# EAGLE design gasLP_Control (EAGLE 7.5.0)
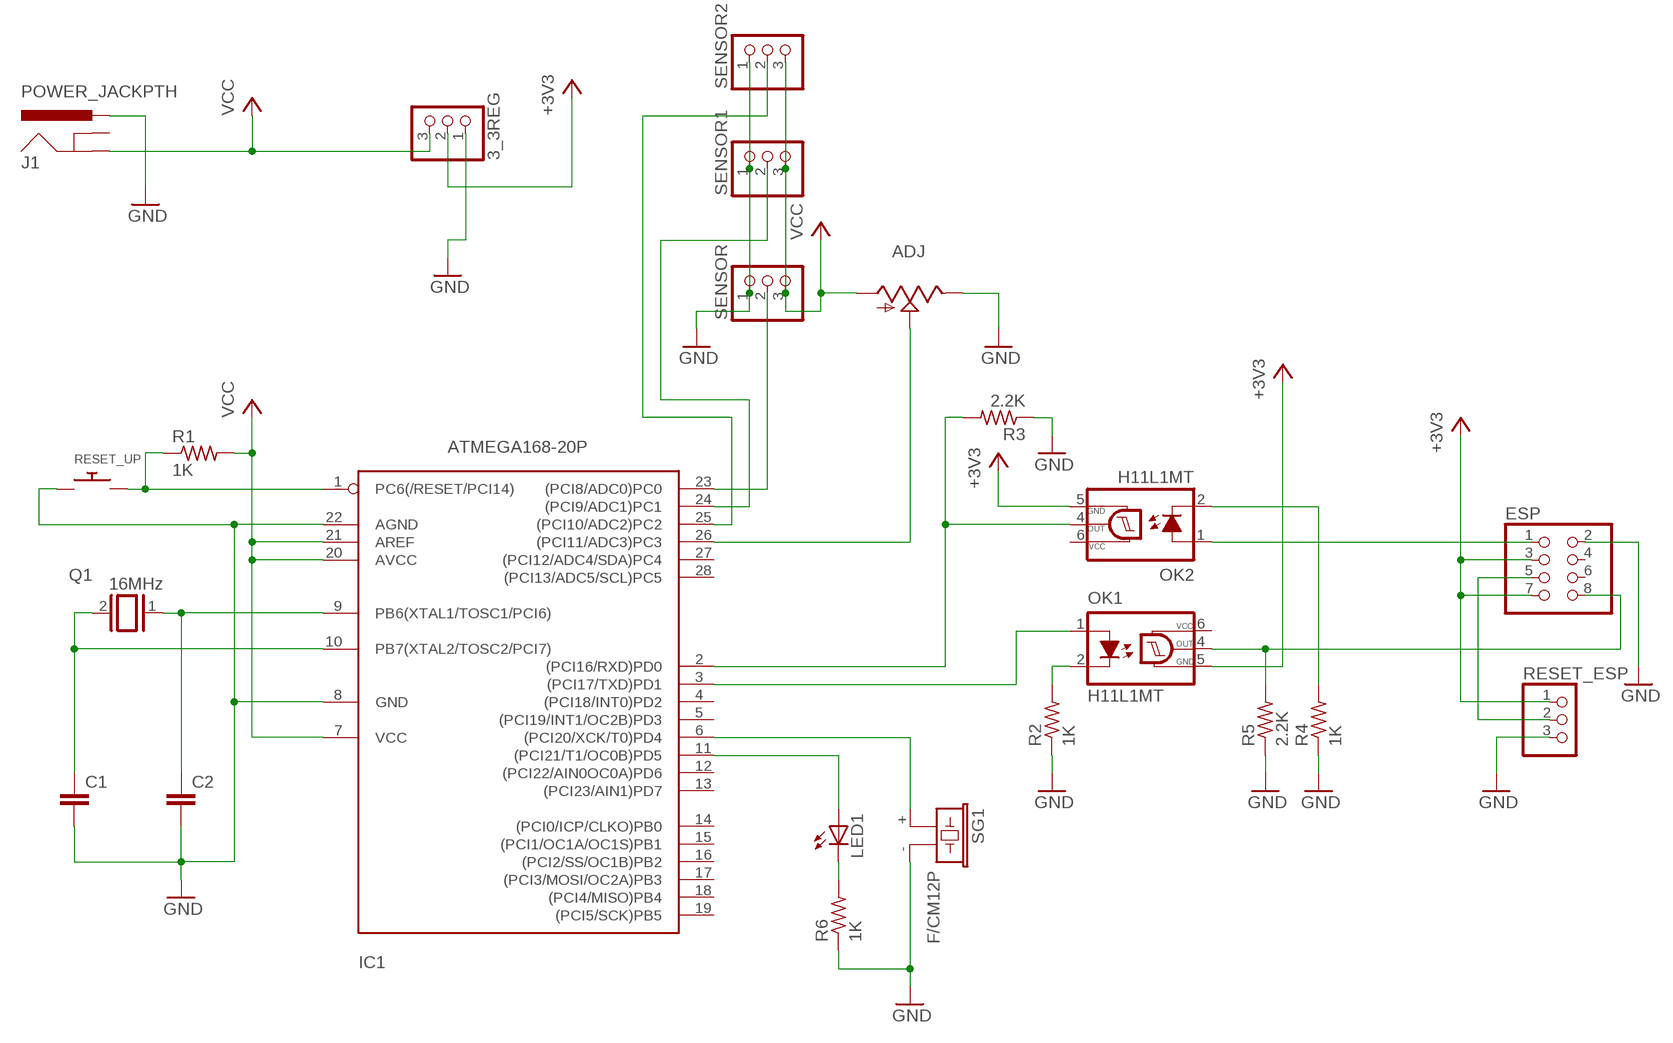
[diagram p0: schematic, sheet 1]

## Parts
3_3REG  PINHD-1X3  [1X03]
ADJ  TRIM_US-B25P  [B25P]
C1  C-EU025-050X050  [C025-050X050]
C2  C-EU025-050X050  [C025-050X050]
ESP  PINHD-2X4  [2X04]
IC1  ATMEGA168-20P  [DIL28-3]
J1  POWER_JACKPTH  [POWER_JACK_PTH]
LED1  LED5MM  [LED5MM]
OK1  H11L1MT  [DIL6-04]
OK2  H11L1MT  [DIL6-04]
Q1  16MHz  XTAL  [Q]
R1  1K  R-US_0204/7  [0204/7]
R2  1K  R-US_0204/7  [0204/7]
R3  2.2K  R-US_0204/7  [0204/7]
R4  1K  R-US_0204/7  [0204/7]
R5  2.2K  R-US_0204/7  [0204/7]
R6  1K  R-US_0204/7  [0204/7]
RESET_ESP  PINHD-1X3  [1X03]
RESET_UP  SWITCH_PUSHBUTTONEVQ-PE  [TACT_PANA-EVQ]
SENSOR  PINHD-1X3  [1X03]
SENSOR1  PINHD-1X3  [1X03]
SENSOR2  PINHD-1X3  [1X03]
SG1  F/CM12P  [F/CM12P]

## Nets
+3V3: 3_3REG.2 ESP.3 ESP.7 OK1.5(GND) OK2.5(GND) RESET_ESP.1
GND: 3_3REG.1 ADJ.E C1.2 C2.2 ESP.2 IC1.8(GND) IC1.22(AGND) J1.PWR R2.1 R3.1 R4.1 R5.1 R6.1 RESET_ESP.3 RESET_UP.P$1 SENSOR1.1 SENSOR2.1 SENSOR.1 SG1.-
N$1: C1.1 IC1.10(PB7(XTAL2/TOSC2/PCI7)) Q1.2
N$2: C2.1 IC1.9(PB6(XTAL1/TOSC1/PCI6)) Q1.1
N$3: IC1.3((PCI17/TXD)PD1) OK1.1(A)
N$4: OK1.2(C) R2.2
N$5: IC1.1(PC6(/RESET/PCI14)) R1.1 RESET_UP.P$2
N$6: IC1.2((PCI16/RXD)PD0) OK2.4(OUT) R3.2
N$7: IC1.6((PCI20/XCK/T0)PD4) SG1.+
N$8: OK2.2(C) R4.2
N$9: ESP.8 OK1.4(OUT) R5.2
N$10: ESP.1 OK2.1(A)
N$11: ESP.5 RESET_ESP.2
N$12: IC1.11((PCI21/T1/OC0B)PD5) LED1.A
N$13: LED1.K(C) R6.2
N$14: IC1.23((PCI8/ADC0)PC0) SENSOR.2
N$16: ADJ.S IC1.26((PCI11/ADC3)PC3)
N$17: IC1.24((PCI9/ADC1)PC1) SENSOR1.2
N$18: IC1.25((PCI10/ADC2)PC2) SENSOR2.2
VCC: 3_3REG.3 ADJ.A IC1.7(VCC) IC1.20(AVCC) IC1.21(AREF) J1.GND R1.2 SENSOR1.3 SENSOR2.3 SENSOR.3
Unconnected: ESP.4 ESP.6 IC1.4((PCI18/INT0)PD2) IC1.5((PCI19/INT1/OC2B)PD3) IC1.12((PCI22/AIN0OC0A)PD6) IC1.13((PCI23/AIN1)PD7) IC1.14((PCI0/ICP/CLKO)PB0) IC1.15((PCI1/OC1A/OC1S)PB1) IC1.16((PCI2/SS/OC1B)PB2) IC1.17((PCI3/MOSI/OC2A)PB3) IC1.18((PCI4/MISO)PB4) IC1.19((PCI5/SCK)PB5) IC1.27((PCI12/ADC4/SDA)PC4) IC1.28((PCI13/ADC5/SCL)PC5) J1.GNDBREAK

## Power pins joined to a net without a drawn wire
VCC: OK1.6(VCC) OK2.6(VCC)

## Library data of the parts
3_3REG RESET_ESP SENSOR SENSOR1 SENSOR2 = adafruit:PINHD-1X3: PIN HEADER
ADJ = pot:TRIM_US-: POTENTIOMETER
C1 C2 = rcl:C-EU: CAPACITOR, European symbol
ESP = adafruit:PINHD-2X4: PIN HEADER
IC1 = adafruit:ATMEGA168*P: MICROCONTROLLER 16 kBytes FLASH 1 kBytes SRAM 512 Bytes EEPROM USART 8-channel 10 bit ADC
J1 = SparkFun-Connectors:POWER_JACK: Power Jack This is the standard 5.5mm barrel jack for power. The PTH is the most common, proven, reliable, footprint. The Slot footprint only works if the mill layer is transmitted to the PCB fab house so be warned. Mating wall wart : TOL-00298 (and others); PROD_ID: CONN-08197
LED1 = adafruit:LED: LED OSRAM: - CHIPLED LG R971, LG N971, LY N971, LG Q971, LY Q971, LO R971, LY R971 LH N974, LH R974 LS Q976, LO Q976, LY Q976 LO Q996 - Hyper CHIPLED LW Q18S LB Q993, LB Q99A, LB R99A - SideLED LS A670, LO A670, LY A670, LG A670, LP A670 LB A673, LV A673, LT A673, LW A673 LH A674 LY A675 LS A676, LA A676, LO A676, LY A676, LW A676 LS A679, LY A679, LG A679 - Hyper Micro SIDELED® LS Y876, LA Y876, LO Y876, LY Y876 LT Y87S - SmartLED LW L88C, LW L88S LB L89C, LB L89S, LG L890 LS L89K, LO L89K, LY L89K LS L896, LA L896, LO L896, LY L896 - TOPLED LS T670, LO T670, LY T670, LG T670, LP T670 LSG T670, LSP T670, LSY T670, LOP T670, LYG T670 LG T671, LOG T671, LSG T671 LB T673, LV T673, LT T673, LW T673 LH T674 LS T676, LA T676, LO T676, LY T676, LB T676, LH T676, LSB T676, LW T676 LB T67C, LV T67C, LT T67C, LS T67K, LO T67K, LY T67K, LW E67C LS E67B, LA E67B, LO E67B, LY E67B, LB E67C, LV E67C, LT E67C LW T67C LS T679, LY T679, LG T679 LS T770, LO T770, LY T770, LG T770, LP T770 LB T773, LV T773, LT T773, LW T773 LH T774 LS E675, LA E675, LY E675, LS T675 LS T776, LA T776, LO T776, LY T776, LB T776 LHGB T686 LT T68C, LB T68C - Hyper Mini TOPLED® LB M676 - Mini TOPLED Santana® LG M470 LS M47K, LO M47K, LY M47K Source: http://www.osram.convergy.de/
OK1 OK2 = optocoupler:H11L*M: 6-Pin DIP Optocoupler Source: http://www.fairchildsemi.com/ds/H1/H11L2-M.pdf; OC_FARNELL: unknown; OC_NEWARK: unknown
Q1 = special:XTAL: CRYSTAL
R1-R6 = rcl:R-US_: RESISTOR, American symbol
RESET_UP = adafruit:SWITCH_PUSHBUTTON: Buttons SOFTTOUCHSMD_SJ - Soft touch temporary push button (Super Junk Akihabara) Compatible with SKPMANE010 [Mouser: 688-SKPMAN] C&K_KSS = Digikey: KSS221GLFS
SG1 = buzzer:F/CM12P: BUZZER Source: Buerklin; OC_FARNELL: unknown; OC_NEWARK: unknown

## Board
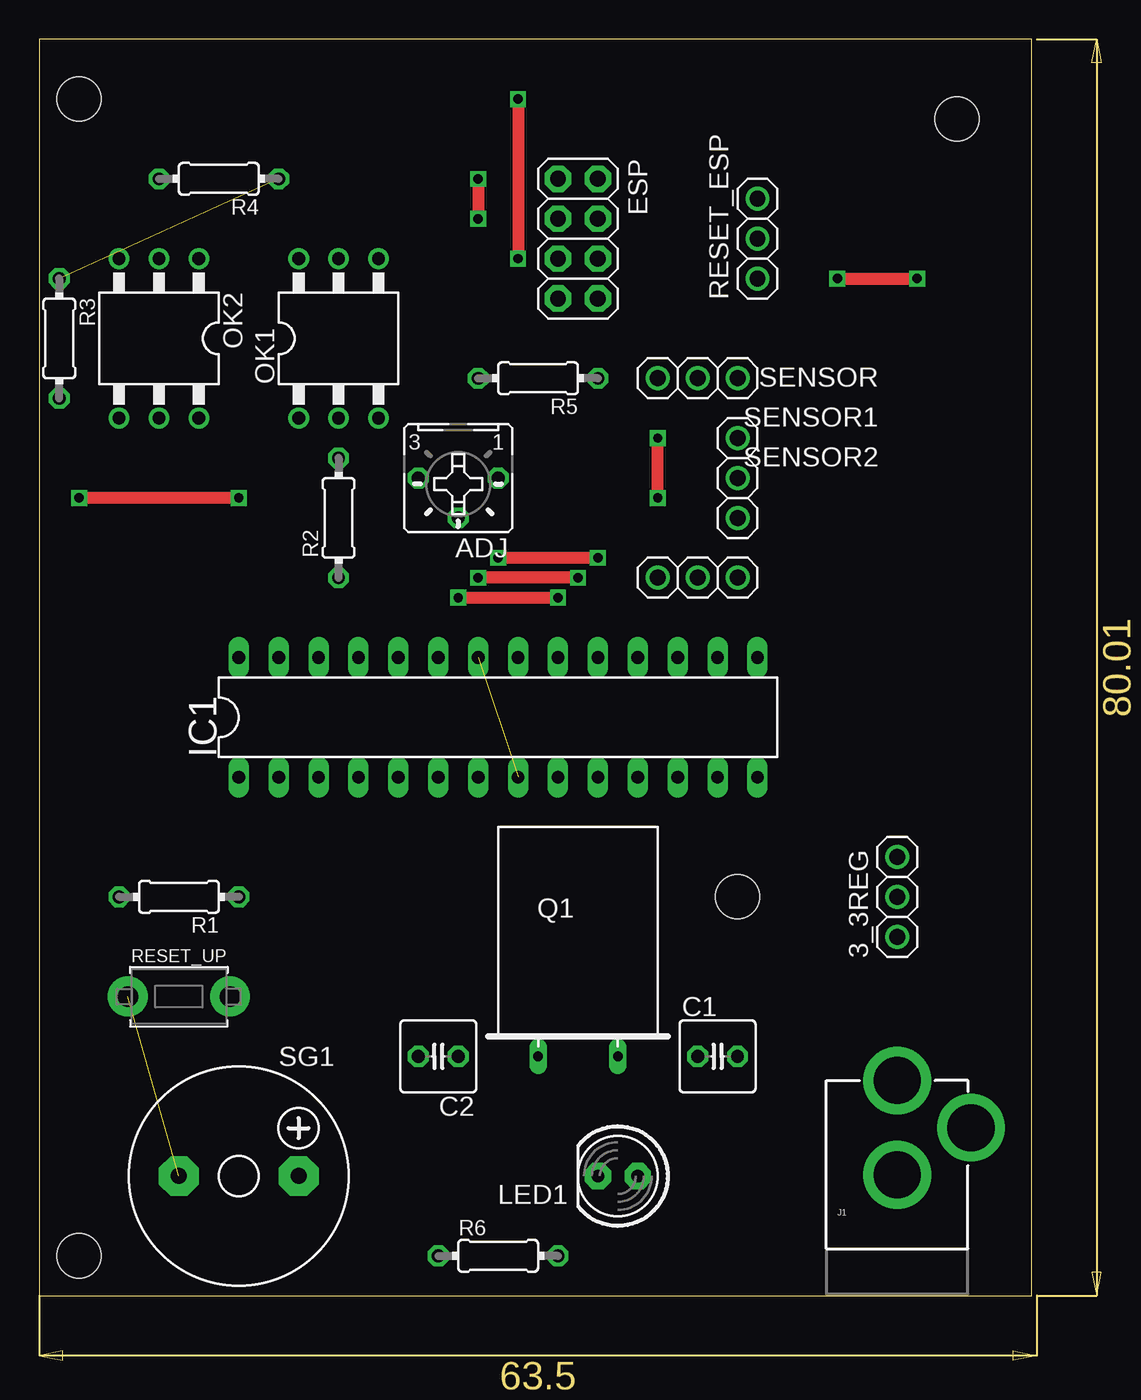
[diagram p1: board, top side]
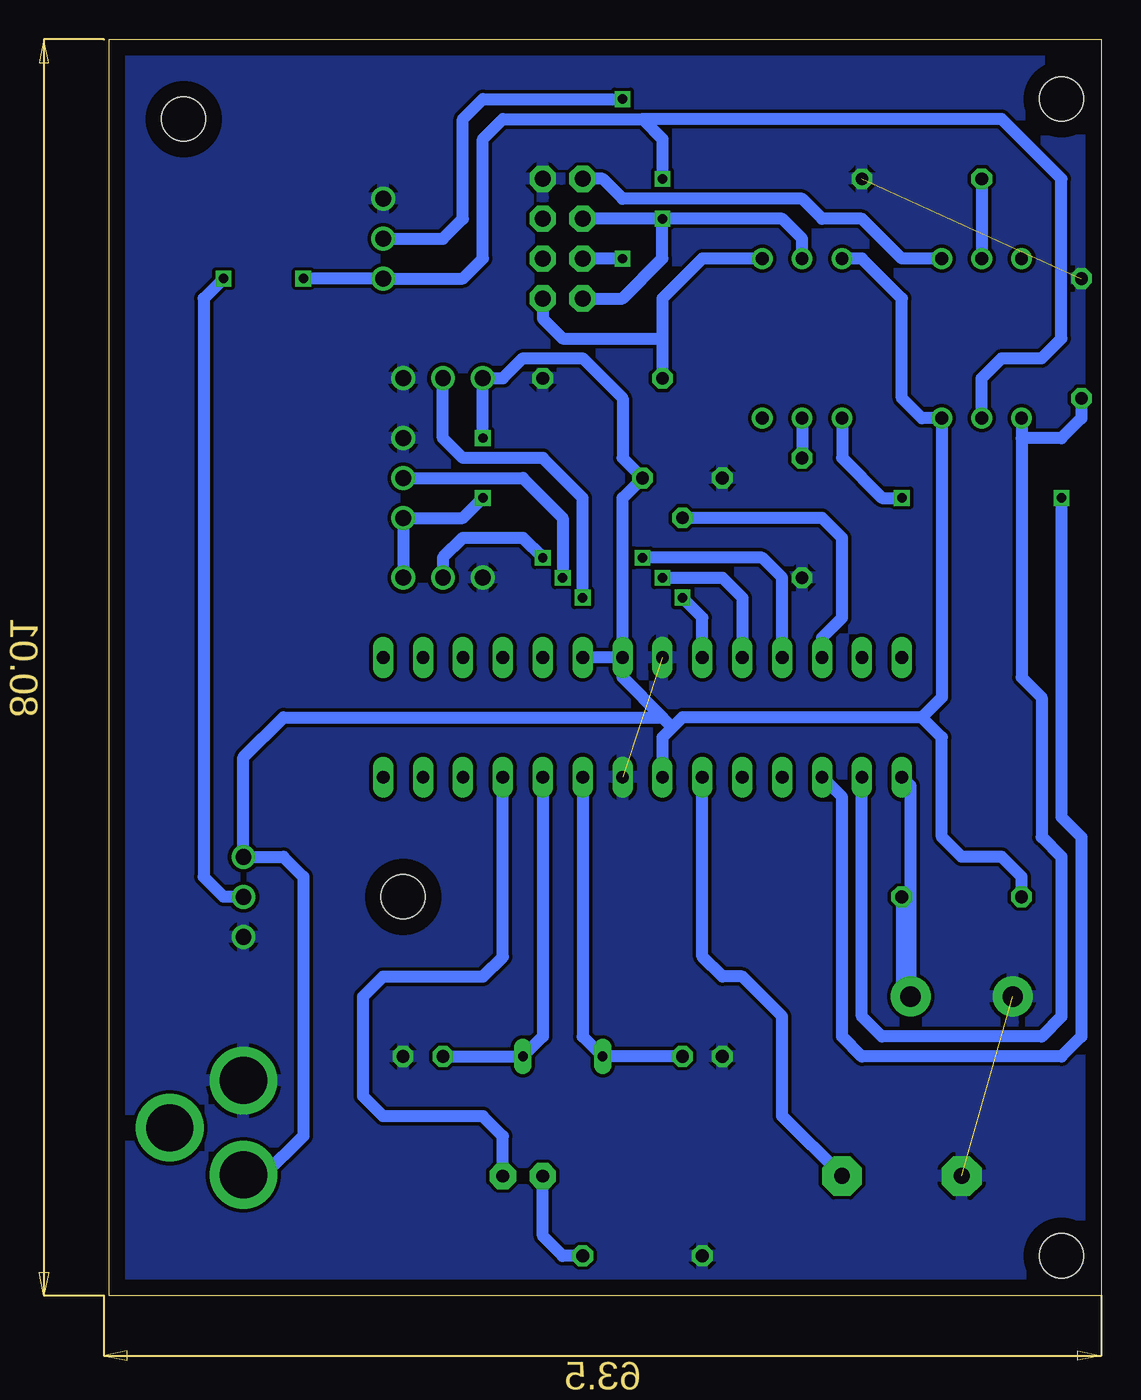
[diagram p2: board, bottom side, seen from below]

Size 63.17 x 80 mm. Coordinates in mm from the lower left corner, seen from the top.
Outline: 0,0 63.17,0 63.17,80 0,80 0,0
Copper layers (1*16): Top 0.035mm / dielectric 1.5mm / Bottom 0.035mm
Design rules "default": minimum track width 10mil, minimum drill 24mil, track to track 8mil, track to pad 8mil, pad to pad 8mil, via to via 8mil, smd to smd 8mil, copper to edge 40mil, drill to drill 8mil, minimum pad ring 10mil, minimum via ring 8mil, stop-mask expansion 4mil, vias tented up to drill 0mil, thermal gap 10mil
Holes 2.8 mm at 58.42,74.93 2.54,76.2 2.54,2.54 44.45,25.4

### Footprints (pad centres in the part's own frame; a part is rotated, then mirrored left to right if it is on the bottom)
1X03 = drill 1.016: 1 -2.54,0; 2 0,0; 3 2.54,0
B25P = drill 0.813 octagon: A -2.54,0; E 2.54,0; S 0,2.54
C025-050X050 = drill 0.813 octagon: 1 -1.27,0; 2 1.27,0
2X04 = drill 1.016 pad 1.676 octagon: 1 -3.81,-1.27; 2 -3.81,1.27; 3 -1.27,-1.27; 4 -1.27,1.27; 5 1.27,-1.27; 6 1.27,1.27; 7 3.81,-1.27; 8 3.81,1.27
DIL28-3 = drill 0.813 long: 1 -16.51,-3.81; 2 -13.97,-3.81; 3 -11.43,-3.81; 4 -8.89,-3.81; 5 -6.35,-3.81; 6 -3.81,-3.81; 7 -1.27,-3.81; 8 1.27,-3.81; 9 3.81,-3.81; 10 6.35,-3.81; 11 8.89,-3.81; 12 11.43,-3.81; 13 13.97,-3.81; 14 16.51,-3.81; 15 16.51,3.81; 16 13.97,3.81; 17 11.43,3.81; 18 8.89,3.81; 19 6.35,3.81; 20 3.81,3.81; 21 1.27,3.81; 22 -1.27,3.81; 23 -3.81,3.81; 24 -6.35,3.81; 25 -8.89,3.81; 26 -11.43,3.81; 27 -13.97,3.81; 28 -16.51,3.81
POWER_JACK_PTH = drill 2.997 pad 4.318: GND 0,7.7; GNDBREAK 4.7,10.7; PWR 0,13.7
LED5MM = drill 0.813 pad 1.676 octagon: A -1.27,0; K 1.27,0
DIL6-04 = drill 0.813: 1 -2.54,-5.08; 2 0,-5.08; 3 2.54,-5.08; 4 2.54,5.08; 5 0,5.08; 6 -2.54,5.08
Q = drill 0.61 long: 1 -2.54,-7.62; 2 2.54,-7.62
0204/7 = drill 0.813 octagon: 1 -3.81,0; 2 3.81,0
TACT_PANA-EVQ = drill 1.3 pad 2.54: P$1 -3.25,0; P$2 3.25,0
F/CM12P = drill 1.016 pad 2.54 octagon: + 3.81,0; - -3.81,0

### Placement (x,y rotation side)
3_3REG  54.61,25.4 90 top
ADJ  26.67,52.07 180 top
C1  43.18,15.24 0 top
C2  25.4,15.24 180 top
ESP  34.29,67.31 270 top
IC1  29.21,36.83 0 top
J1  54.61,0 0 top
LED1  36.83,7.62 180 top
OK1  19.05,60.96 0 top
OK2  7.62,60.96 180 top
Q1  34.29,22.86 0 top
R1  8.89,25.4 180 top
R2  19.05,49.53 90 top
R3  1.27,60.96 270 top
R4  11.43,71.12 180 top
R5  31.75,58.42 180 top
R6  29.21,2.54 0 top
RESET_ESP  45.72,67.31 90 top
RESET_UP  8.89,19.05 0 top
SENSOR  41.91,58.42 180 top
SENSOR1  44.45,52.07 270 top
SENSOR2  41.91,45.72 0 top
SG1  12.7,7.62 0 top

### Tracks (layer width: path | path; a pad name or v marks a point on that pad's centre or on a via)
+3V3  (via drill 0.6)
  Top 0.762: v27.94,71.12 v27.94,68.58 | v50.8,64.77 v55.88,64.77
  Bottom 0.762: OK1.5 19.05,67.31 20.32,68.58 v27.94,68.58 | v27.94,68.58 ESP.3 | ESP.7 30.48,63.5 27.94,66.04 v27.94,68.58 | 29.21,74.93 38.1,74.93 39.37,73.66 39.37,66.04 40.64,64.77 RESET_ESP.1 v50.8,64.77 | 29.21,74.93 27.94,73.66 v27.94,71.12 | OK2.5 7.62,58.42 6.35,59.69 3.81,59.69 2.54,60.96 2.54,71.12 6.35,74.93 29.21,74.93 | 3_3REG.2 55.88,25.4 57.15,26.67 57.15,63.5 v55.88,64.77
GND  (3 unrouted)
  pour Bottom (isolate 0.229): 0,80.01 64.77,80.01 64.77,0 0,0
N$1
  Bottom 0.762: IC1.10 35.56,16.51 Q1.2 C1.1
N$2
  Bottom 0.762: C2.1 Q1.1 33.02,16.51 IC1.9
N$3  (via drill 0.6)
  Top 0.762: v12.7,50.8 v2.54,50.8
  Bottom 0.762: OK1.1 16.51,53.34 13.97,50.8 v12.7,50.8 | v2.54,50.8 2.54,30.48 1.27,29.21 1.27,16.51 2.54,15.24 15.24,15.24 16.51,16.51 16.51,31.75 IC1.3
N$4
  Bottom 0.762: OK1.2 R2.2
N$5
  Bottom 0.762: R1.1 12.7,19.61 RESET_UP.P$2 12.14,32.46 IC1.1
N$6
  Bottom 0.762: OK2.4 5.08,54.61 | 5.08,54.61 5.08,39.37 3.81,38.1 3.81,29.21 2.54,27.94 2.54,17.78 3.81,16.51 13.97,16.51 15.24,17.78 IC1.2 | R3.2 1.27,55.88 2.54,54.61 5.08,54.61
N$7
  Bottom 0.762: SG1.+ 20.32,11.43 20.32,17.78 22.86,20.32 24.13,20.32 25.4,21.59 IC1.6
N$8
  Bottom 0.762: R4.2 OK2.2
N$9
  Bottom 0.762: OK1.4 25.4,66.04 27.94,63.5 27.94,60.96 | 27.94,60.96 R5.2 | ESP.8 35.56,62.23 34.29,60.96 27.94,60.96
N$10
  Bottom 0.762: OK2.1 12.7,66.04 15.24,68.58 17.78,68.58 19.05,69.85 30.48,69.85 31.75,71.12 ESP.1
N$11  (via drill 0.6)
  Top 0.762: v30.48,76.2 v30.48,66.04
  Bottom 0.762: RESET_ESP.2 41.91,67.31 40.64,68.58 40.64,74.93 39.37,76.2 v30.48,76.2 | v30.48,66.04 ESP.5
N$12
  Bottom 0.762: LED1.A 38.1,10.16 39.37,11.43 45.72,11.43 46.99,12.7 46.99,19.05 45.72,20.32 39.37,20.32 38.1,21.59 IC1.11
N$13
  Bottom 0.762: R6.2 34.29,2.54 35.56,3.81 LED1.K
N$14  (via drill 0.6)
  Top 0.762: v26.67,44.45 v33.02,44.45
  Bottom 0.762: IC1.23 25.4,43.18 v26.67,44.45 | v33.02,44.45 33.02,50.8 35.56,53.34 40.64,53.34 41.91,54.61 SENSOR.2
N$16
  Bottom 0.762: IC1.26 17.78,41.91 16.51,43.18 16.51,48.26 17.78,49.53 ADJ.S
N$17  (via drill 0.6)
  Top 0.762: v34.29,45.72 v27.94,45.72
  Bottom 0.762: SENSOR1.2 36.83,52.07 34.29,49.53 v34.29,45.72 | v27.94,45.72 24.13,45.72 22.86,44.45 IC1.24
N$18  (via drill 0.6)
  Top 0.762: v29.21,46.99 v35.56,46.99
  Bottom 0.762: IC1.25 20.32,45.72 21.59,46.99 v29.21,46.99 | v35.56,46.99 36.83,48.26 40.64,48.26 41.91,46.99 SENSOR2.2
VCC  (via drill 0.6)
  Top 0.762: v39.37,50.8 v39.37,54.61
  Bottom 0.762: 11.43,36.83 10.16,38.1 OK2.6 11.43,55.88 12.7,57.15 12.7,63.5 15.24,66.04 OK1.6 | 11.43,36.83 26.67,36.83 27.3,36.2 | 27.3,36.2 27.94,35.56 IC1.7 | IC1.21 30.48,39.37 27.94,36.83 | 27.94,36.83 27.3,36.2 | R1.2 5.08,26.67 6.35,27.94 8.89,27.94 10.16,29.21 10.16,35.56 11.43,36.83 | 27.94,36.83 52.07,36.83 54.61,34.29 3_3REG.3 52.07,27.94 50.8,26.67 50.8,10.16 53.34,7.62 54.53,7.62 J1.GND | SENSOR2.3 SENSOR1.3 40.64,49.53 v39.37,50.8 | IC1.21 30.48,50.8 ADJ.A 30.48,53.34 30.48,57.15 33.02,59.69 36.83,59.69 38.1,58.42 SENSOR.3 v39.37,54.61 | IC1.21 IC1.20